# EAGLE design cytron st (EAGLE 9.3.1)
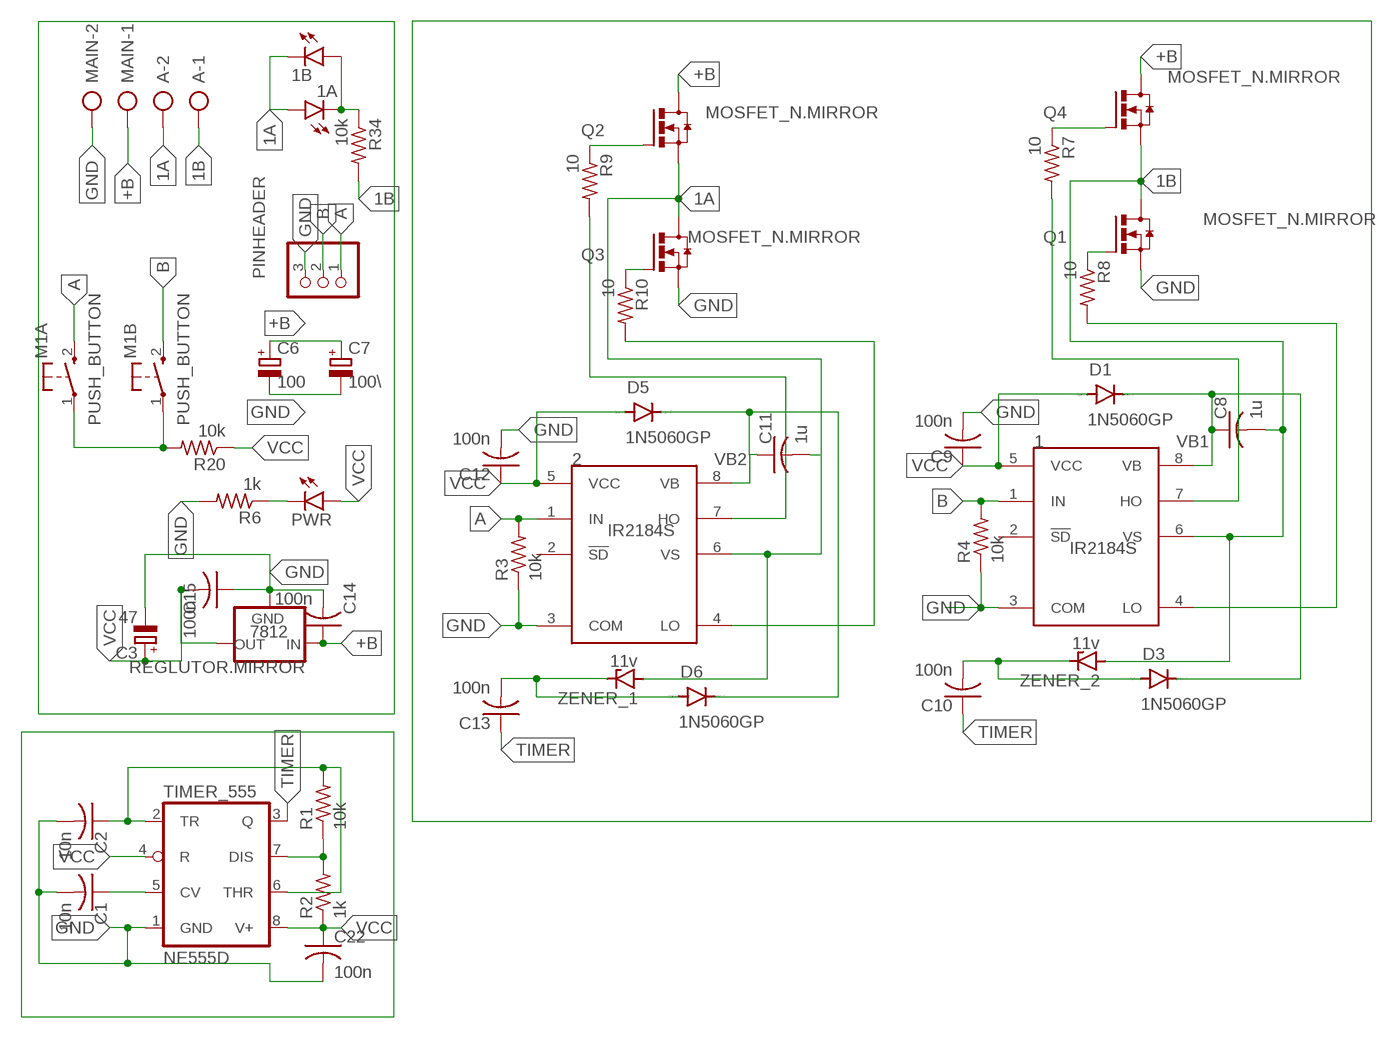
[diagram p0: schematic, sheet 1]

## Parts
1  IR2184S  [SO08]
1A  LED3MM  [LED3MM]
1B  LED3MM  [LED3MM]
2  IR2184S  [SO08]
7812  REGLUTOR.MIRROR  [78XXL.MIRROR]
A  AK300/22  [XTALRR488W60L1090T465H350B]
C1  10n  C-US025-025X050  [C025-025X050]
C2  10n  C-US025-025X050  [C025-025X050]
C3  47  CPOL-EUE5-10.5  [E5-10,5]
C6  100  CPOL-EUE5-10.5  [E5-10,5]
C7  100\  CPOL-EUE5-10.5  [E5-10,5]
C8  1u  C-US025-025X050  [C025-025X050]
C9  100n  C-US025-025X050  [C025-025X050]
C10  100n  C-US025-025X050  [C025-025X050]
C11  1u  C-US025-025X050  [C025-025X050]
C12  100n  C-US025-025X050  [C025-025X050]
C13  100n  C-US025-025X050  [C025-025X050]
C14  100n  C-US025-025X050  [C025-025X050]
C15  100n  C-US025-025X050  [C025-025X050]
C22  100n  C-US025-025X050  [C025-025X050]
D1  1N5060GP  [DO15-12]
D3  1N5060GP  [DO15-12]
D5  1N5060GP  [DO15-12]
D6  1N5060GP  [DO15-12]
M1A  PUSH_BUTTON  [B3F-10XX]
M1B  PUSH_BUTTON  [B3F-10XX]
MAIN  AK300/22  [XTALRR488W60L1090T465H350B]
PINHEADER  PINHD-1X3  [1X03]
PWR  LED5MM  [LED5MM]
Q1  MOSFET_N.MIRROR  [TO220.MIRROR]
Q2  MOSFET_N.MIRROR  [TO220.MIRROR]
Q3  MOSFET_N.MIRROR  [TO220.MIRROR]
Q4  MOSFET_N.MIRROR  [TO220.MIRROR]
R1  10k  R-US_0207/2V  [0207/2V]
R2  1k  R-US_0207/2V  [0207/2V]
R3  10k  R-US_0207/2V  [0207/2V]
R4  10k  R-US_0207/2V  [0207/2V]
R6  1k  R-US_0207/5V  [0207/5V]
R7  10  R-US_0207/5V  [0207/5V]
R8  10  R-US_0207/5V  [0207/5V]
R9  10  R-US_0207/5V  [0207/5V]
R10  10  R-US_0207/5V  [0207/5V]
R20  10k  R-US_0207/5V  [0207/5V]
R34  10k  R-US_0207/5V  [0207/5V]
TIMER_555  NE555D  [SO08]
ZENER_1  11v  BZD23  [SOD81]
ZENER_2  11v  BZD23  [SOD81]

## Nets
1A: 1A.A 1B.K(C) 2.6(VS) A.2 C11.2 Q2.S Q3.D ZENER_1.A
1B: 1.6(VS) A.1 C8.2 Q1.D Q4.S R34.2 ZENER_2.A
+B: 7812.IN C6.+ C7.+ C14.1 MAIN.1 Q2.D Q4.D
A: 2.1(IN) M1A.2(S) PINHEADER.1 R3.2
B: 1.1(IN) M1B.2(S) PINHEADER.2 R4.2
GND: 1.3(COM) 2.3(COM) 7812.GND C1.2 C2.2 C3.- C6.- C7.- C9.2 C12.2 C14.2 C15.1 C22.2 MAIN.2 PINHEADER.3 Q1.S Q3.S R3.1 R4.1 R6.2 TIMER_555.1(GND)
N$1: PWR.K(C) R6.1
N$2: C1.1 TIMER_555.5(CV)
N$3: R1.1 R2.2 TIMER_555.7(DIS)
N$4: C2.1 R1.2 TIMER_555.2(TR) TIMER_555.6(THR)
N$7: M1A.1(P) M1B.1(P) R20.2
N$9: Q4.G R7.1
N$10: Q1.G R8.1
N$12: 1.4(LO) R8.2
N$13: 1.7(HO) R7.2
N$14: C10.2 D3.A ZENER_2.C
N$15: Q3.G R10.1
N$16: Q2.G R9.1
N$17: 2.4(LO) R10.2
N$18: 2.7(HO) R9.2
N$20: C13.2 D6.A ZENER_1.C
N$45: 1A.K(C) 1B.A R34.1
TIMER: C10.1 C13.1 TIMER_555.3(Q)
VB1: 1.8(VB) C8.1 D1.C D3.C
VB2: 2.8(VB) C11.1 D5.C D6.C
VCC: 1.5(VCC) 2.5(VCC) 7812.OUT C3.+ C9.1 C12.1 C15.2 C22.1 D1.A D5.A PWR.A R2.1 R20.1 TIMER_555.4(R) TIMER_555.8(V+)
Unconnected: 1.2(!SD) 2.2(!SD)

## Library data of the parts
1 2 = irs:IR2184
1A 1B PWR = led:LED: LED OSRAM: - CHIPLED LG R971, LG N971, LY N971, LG Q971, LY Q971, LO R971, LY R971 LH N974, LH R974 LS Q976, LO Q976, LY Q976 LO Q996 - Hyper CHIPLED LW Q18S LB Q993, LB Q99A, LB R99A - SideLED LS A670, LO A670, LY A670, LG A670, LP A670 LB A673, LV A673, LT A673, LW A673 LH A674 LY A675 LS A676, LA A676, LO A676, LY A676, LW A676 LS A679, LY A679, LG A679 - Hyper Micro SIDELED® LS Y876, LA Y876, LO Y876, LY Y876 LT Y87S - SmartLED LW L88C, LW L88S LB L89C, LB L89S, LG L890 LS L89K, LO L89K, LY L89K LS L896, LA L896, LO L896, LY L896 - TOPLED LS T670, LO T670, LY T670, LG T670, LP T670 LSG T670, LSP T670, LSY T670, LOP T670, LYG T670 LG T671, LOG T671, LSG T671 LB T673, LV T673, LT T673, LW T673 LH T674 LS T676, LA T676, LO T676, LY T676, LB T676, LH T676, LSB T676, LW T676 LB T67C, LV T67C, LT T67C, LS T67K, LO T67K, LY T67K, LW E67C LS E67B, LA E67B, LO E67B, LY E67B, LB E67C, LV E67C, LT E67C LW T67C LS T679, LY T679, LG T679 LS T770, LO T770, LY T770, LG T770, LP T770 LB T773, LV T773, LT T773, LW T773 LH T774 LS E675, LA E675, LY E675, LS T675 LS T776, LA T776, LO T776, LY T776, LB T776 LHGB T686 LT T68C, LB T68C - Hyper Mini TOPLED® LB M676 - Mini TOPLED Santana® LG M470 LS M47K, LO M47K, LY M47K Source: http://www.osram.convergy.de LUXEON: - LUMILED® LXK2-PW12-R00, LXK2-PW12-S00, LXK2-PW14-U00, LXK2-PW14-V00 LXK2-PM12-R00, LXK2-PM12-S00, LXK2-PM14-U00 LXK2-PE12-Q00, LXK2-PE12-R00, LXK2-PE12-S00, LXK2-PE14-T00, LXK2-PE14-U00 LXK2-PB12-K00, LXK2-PB12-L00, LXK2-PB12-M00, LXK2-PB14-N00, LXK2-PB14-P00, LXK2-PB14-Q00 LXK2-PR12-L00, LXK2-PR12-M00, LXK2-PR14-Q00, LXK2-PR14-R00 LXK2-PD12-Q00, LXK2-PD12-R00, LXK2-PD12-S00 LXK2-PH12-R00, LXK2-PH12-S00 LXK2-PL12-P00, LXK2-PL12-Q00, LXK2-PL12-R00 Source: www.luxeon.com KINGBRIGHT: KA-3528ASYC Source: www.kingbright.com
7812 = MOSFET MIRROR:REGLUTOR.MIRROR
A MAIN = con-ptr50056:AK300/2: CONNECTOR
C1 C2 C9 C10 C12-C15 C22 = rcl8:C-US: CAPACITOR, American symbol; SPICEPREFIX: C
C3 C6 C7 = rcl8:CPOL-EU: POLARIZED CAPACITOR, European symbol; SPICEPREFIX: C
C8 C11 = rcl:C-US: CAPACITOR, American symbol; SPICEPREFIX: C
D1 D3 D5 D6 = diode:1N5060GP: DIODE controlled avalanche rectifier
M1A M1B = MIA_LIBRARY (1):PUSH_BUTTON: OMRON SWITCH
PINHEADER = pinhead:PINHD-1X3: PIN HEADER
Q1-Q4 = MIA_LIBRARY (1):MOSFET_N.MIRROR
R1-R4 R6-R10 R20 R34 = rcl:R-US_: RESISTOR, American symbol; SPICEPREFIX: R
TIMER_555 = linear:*555: TIMER
ZENER_1 ZENER_2 = diode:BZD23: Z DIODE

## Board
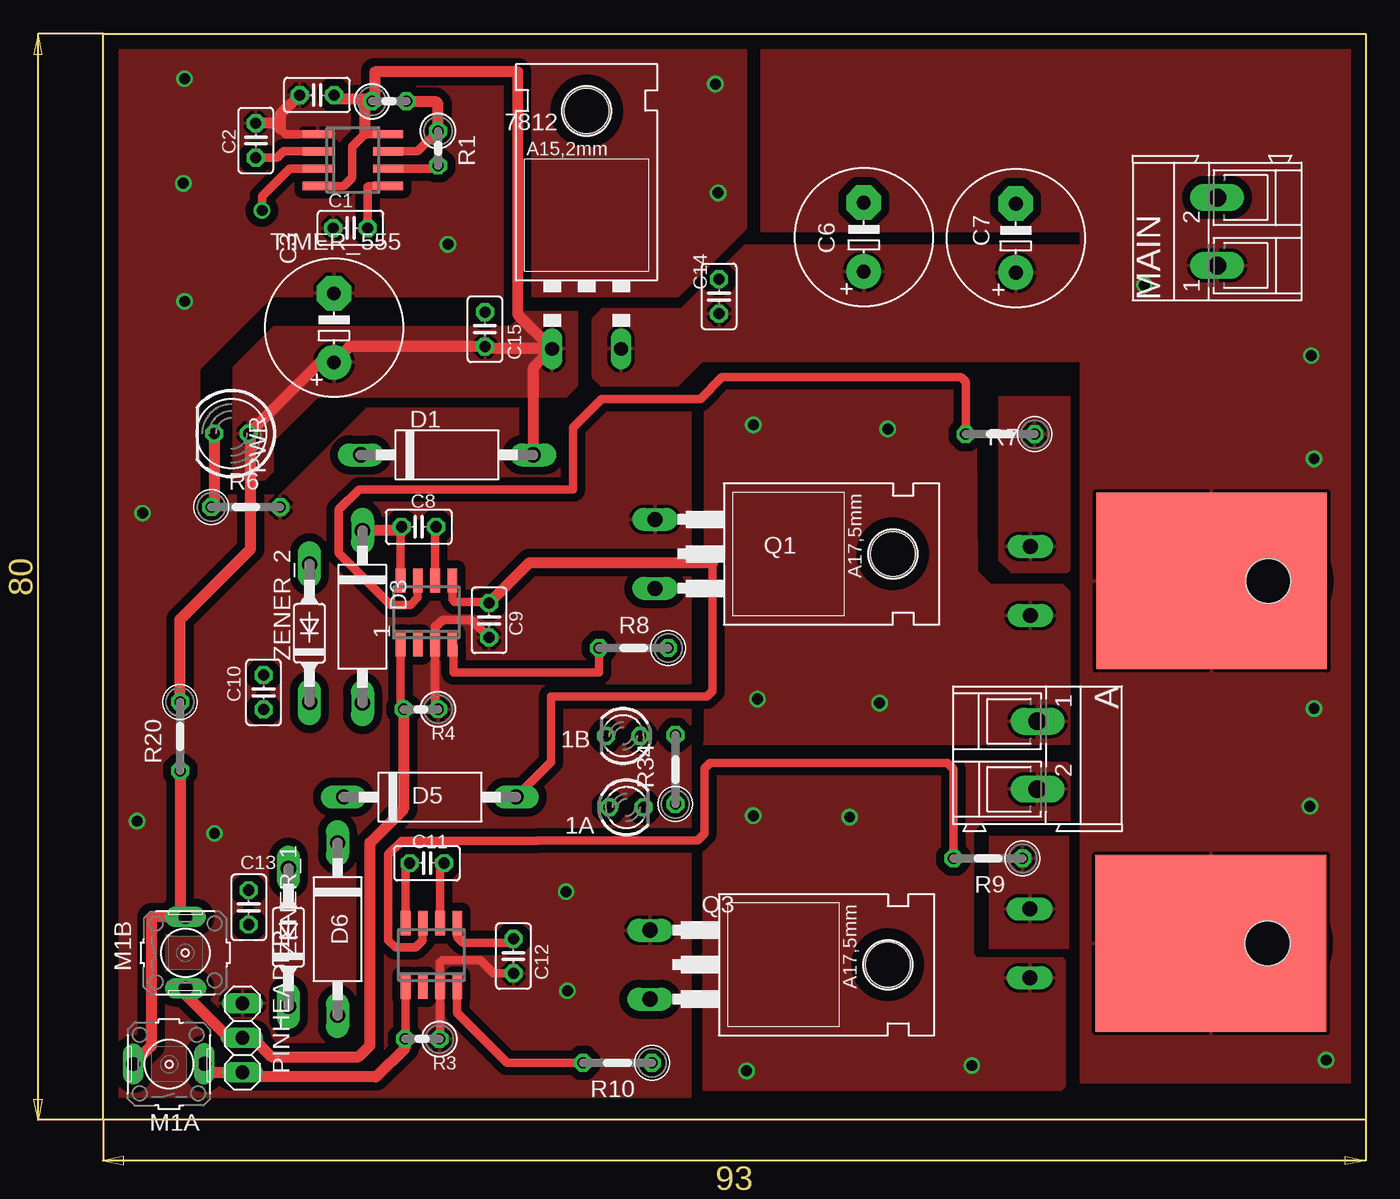
[diagram p1: board, top side]
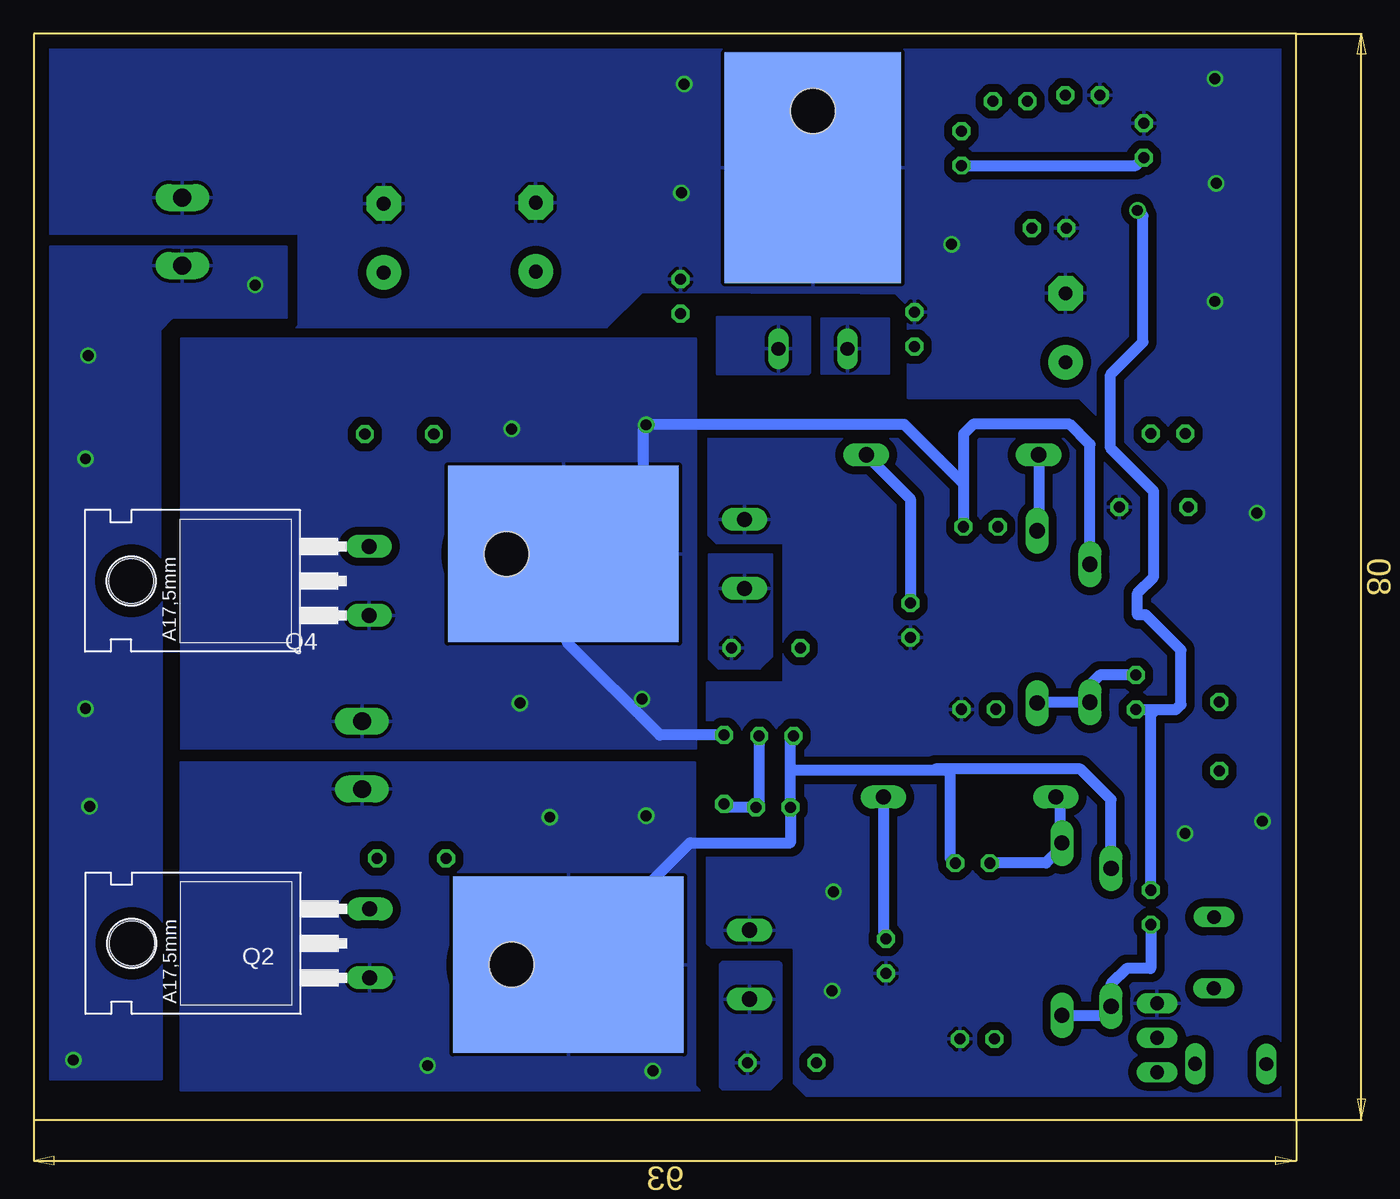
[diagram p2: board, bottom side, seen from below]

Size 93 x 80 mm. Coordinates in mm from the lower left corner, seen from the top.
Outline: 0,0 0,80 93,80 93,0 0,0
Copper layers (1*16): Top 0.035mm / dielectric 1.5mm / Bottom 0.035mm
Design rules "default *": minimum track width 0.015240625mm, minimum drill 0.8mm, track to track 0.6mm, track to pad 0.6mm, pad to pad 0.4mm, via to via 6mil, smd to smd 6mil, copper to edge 40mil, drill to drill 6mil, minimum pad ring 10mil, minimum via ring 8mil, stop-mask expansion 4mil, vias tented up to drill 0mil, thermal gap 10mil

### Footprints (pad centres in the part's own frame; a part is rotated, then mirrored left to right if it is on the bottom)
SO08 = smd 0.72 x 1.78: 1 -1.905,-2.35; 2 -0.635,-2.35; 3 0.635,-2.35; 4 1.905,-2.35; 5 1.905,2.35; 6 0.635,2.35; 7 -0.635,2.35; 8 -1.905,2.35
LED3MM = drill 0.813 octagon: A -1.27,0; K 1.27,0
78XXL.MIRROR = smd 13 x 17 bottom: GND 0,7 | drill 1.016 long: IN 2.54,-6.35; OUT -2.54,-6.35 | hole 3.302: 0,11.176
XTALRR488W60L1090T465H350B = drill 1.321 long: 1 -2.515,-1.27; 2 2.489,-1.27
C025-025X050 = drill 0.813 octagon: 1 -1.27,0; 2 1.27,0
E5-10,5 = drill 1.016 pad 2.54: + -2.54,0 | drill 1.016 pad 2.54 octagon: - 2.54,0
DO15-12 = drill 1.118 long: A 6.35,0; C -6.35,0
B3F-10XX = drill 1.016 long: 1 0.013,2.636; 2 0.029,-2.605
1X03 = drill 1.016 long: 1 -2.54,0; 2 0,0; 3 2.54,0
LED5MM = drill 0.813 octagon: A -1.27,0; K 1.27,0
TO220.MIRROR = smd 13 x 17 bottom: D 0,7 | drill 1.118 long: G 2.54,-6.35; S -2.54,-6.35 | hole 3.302: 0,11.176
0207/2V = drill 0.813 octagon: 1 -1.27,0; 2 1.27,0
0207/5V = drill 0.813 octagon: 1 -2.54,0; 2 2.54,0
SO08' = smd 0.6 x 2.2: 1 -1.905,-2.6; 2 -0.635,-2.6; 3 0.635,-2.6; 4 1.905,-2.6; 5 1.905,2.6; 6 0.635,2.6; 7 -0.635,2.6; 8 -1.905,2.6
SOD81 = drill 1.118 long: A 5.08,0; C -5.08,0

### Placement (x,y rotation side)
1  23.82,37.38 0 top
1A  38.55,23.02 0 top
1B  38.3,28.28 180 top
2  24.18,12.14 0 top
7812  35.62,63.15 0 top
A  70.1,26.85 270 top
C1  18.22,65.7 180 top
C2  11.25,72.15 90 top
C3  17,58.35 90 top
C6  56.03,65.03 90 top
C7  67.23,64.96 90 top
C8  23.25,43.69 0 top
C9  28.43,36.8 270 top
C10  11.82,31.49 90 top
C11  23.85,18.91 0 top
C12  30.22,12.06 270 top
C13  10.72,15.65 270 top
C14  45.37,60.66 90 top
C15  28.12,58.24 270 top
C22  15.75,75.5 180 top
D1  25.33,48.99 0 top
D3  19.1,37.05 270 top
D5  24.07,23.78 0 top
D6  17.27,14.04 270 top
M1A  4.85,4.1 90 top
M1B  6.05,12.3 0 top
MAIN  80.8,65.45 90 top
PINHEADER  10.26,6.04 90 top
PWR  9.45,50.56 180 top
Q1  47,41.69 270 top
Q2  74.61,13 90 bottom
Q3  46.63,11.43 270 top
Q4  74.65,39.7 90 bottom
R1  24.67,71.58 270 top
R2  21.07,75.04 0 top
R3  23.5,5.95 180 top
R4  23.4,30.25 180 top
R6  10.51,45.14 0 top
R7  66.08,50.51 180 top
R8  39.08,34.76 180 top
R9  65.19,19.26 180.1 top
R10  37.89,4.2 180 top
R20  5.66,28.25 270 top
R34  42.15,25.8 90 top
TIMER_555  NE555D  [SO08']  18.4,70.71 270 top
ZENER_1  13.65,13.45 90 top
ZENER_2  15.2,35.85 90 top

### Tracks (layer width: path | path; a pad name or v marks a point on that pad's centre or on a via)
1A  (via drill 0.8)
  Top 0.61: 2.6 24.82,18.61 C11.2
  Bottom 0.813: Q3.D 44.65,20.41 37.28,20.41 1A.A 37.28,25.75 | 37.28,25.75 37.28,28.03 1B.K | C11.2 25.5,19.29 25.5,25.75 26.5,25.75 | 26.5,25.75 26.6,25.85 15.9,25.85 13.65,23.6 ZENER_1.A | 26.5,25.75 37.28,25.75
  other vias: 64,4 47.4,3.6 47.9,22.4 55,22.3
  pour Bottom (isolate 0.6): 44.3,26.35 44.3,2.55 43.9,2.15 82.2,2.15 82.2,26.35
  pour Top: 71,26.3 44.8,26.3 44.2,25.7 44.2,2.2 70.6,2.2 70.9,2.5 70.9,11.7 70.7,11.9 64.4,11.9 64.1,12.2 64.1,21.3 64.9,22.1 71.1,22.1 71.2,22 71.2,26.1
1B  (via drill 0.8)
  Top 0.61: 1.6 24.45,43.62 C8.2
  Bottom 0.813: Q1.D 60.06,41.69 | Q1.D 48.1,47.59 48.1,51.25 28.9,51.25 24.52,46.87 | 24.52,46.87 C8.2 | ZENER_2.A 15.2,49.75 16.7,51.25 23.8,51.25 24.52,50.53 24.52,46.87 | R34.2 46.89,28.34 53.72,35.17 53.72,38.95 | 53.72,38.95 53.72,39.64 53.58,39.79 53.58,41.97 | Q1.D 54,39.23 53.72,38.95
  other vias: 48.2,31 57.2,30.7 57.8,50.9 47.9,51.2
  pour Bottom (isolate 0.6): 82.2,27.35 44.2,27.35 44.2,57.55 82.2,57.55
  pour Top: 64.31,54.8 44.4,54.8 44.3,54.9 44.3,27.8 44.2,27.7 71.2,27.7 71.2,38.9 70.7,39.4 65.4,39.4 64.41,40.39
+B  (via drill 0.8)
  other vias: 88.9,23.1 90.1,4.4 89.2,30.3 89,56.3 89.2,48.7 76.7,61.5
  pour Top (isolate 0.6): 72,79.35 72,2.75 92.15,2.75 92.15,79.35
  pour Top (isolate 0.6): 73.3,55.85 44.1,55.85 42.3,54.05 36.7,54.05 36.1,54.65 36.1,59.05 36.8,59.75 42.6,59.75 47.3,64.45 73.1,64.45 74,63.55 74,56.55
  pour Bottom (isolate 0.6): 42.7,54.95 35.9,54.95 35.8,55.05 35.8,59.15 42.7,59.15
  pour Bottom (isolate 0.6): 74.4,64.35 74.4,59.05 82.8,59.05 83.7,58.15 83.7,41.15 83.6,41.05 83.6,2.95 91.8,2.95 91.8,64.35
  pour Top (isolate 0.6): 73.2,65.45 48.5,65.45 48.5,78.85 75.9,78.85 75.9,67.05 77.7,65.25 87.6,65.25 87.6,60.25 87.3,59.95 73.5,59.95 73.2,60.25
A
  Top 0.61: R3.2 22.27,6 2.1
  Top 0.813: R3.2 22.23,5.28 20.1,3.15 10.3,3.15 10.26,3.19 PINHEADER.1 8.08,3.5 M1A.2
B
  Top 0.61: 1.1 21.91,30.46 R4.2
  Top 0.813: R4.2 22.13,22.88 19.66,20.41 19.66,5.49 18.83,4.66 12.39,4.66 11.01,6.04 PINHEADER.2 9.06,6.04 9.06,6.24 6.08,9.22 M1B.2
GND  (via drill 0.8)
  Top 0.61: TIMER_555.1 13.44,72.61 13.05,73 12.63,73.42 | C9.2 27.14,36.83 24.99,36.83 24.56,36.4 24.45,36.4 1.3 24.45,30.46 R4.1 | C12.2 28.76,10.79 27.8,11.74 25,11.74 24.8,11.55 24.8,11.06 24.81,11.05 2.3 24.82,6 R3.1
  Top 0.813: 12.63,73.42 C2.2 | C22.2 13.05,74.07 13.05,73
  other vias: 6,76.7 5.9,69 6,60.3 2.9,44.7 2.5,22 8.2,21.1 34.2,9.5 34.1,16.8 25.4,64.5 45.1,76.3 45.3,68.3
  pour Bottom (isolate 0.6): 73.5,58.55 73.5,65.25 92.4,65.25 92.4,79.55 8,79.55 8,60.74 48.21,60.94 50.8,58.35 73.7,58.35
  pour Bottom (isolate 0.6): 37,2.65 37,12.55 37.1,12.65 43.1,12.65 43.4,12.95 43.4,32.25 37.8,32.25 37.8,42.45 42.7,42.45 43.3,43.05 43.3,53.05 42.2,54.15 1,54.15 1,1.75 36.1,1.75
  pour Bottom (isolate 0.6): 43.4,61.45 43.4,79.85 0.9,79.85 0.9,47.95 12.4,47.95 13.9,49.45 13.9,51.05 16,53.15 28.6,53.15 28.6,59.95 30,61.35 43.3,61.35
  pour Top: 47.4,78.9 1.1,78.9 1.1,1.7 43.3,1.7 43.3,52.4 19.4,52.4 13,46 8.8,46 7.1,47.7 7.1,55.3 12.5,60.7 42.4,60.7 47.4,65.7
N$1
  Top 0.813: PWR.K 8.18,45.35 R6.1
N$2
  Top 0.61: TIMER_555.5 19.55,68.8 19.49,68.74 C1.1
N$3
  Top 0.61: TIMER_555.7 23.16,71.34 R1.1
  Top 0.813: R1.1 24.67,74.85 24.48,75.04 R2.2
N$4
  Top 0.61: TIMER_555.2 13.29,71.34 12.83,70.88 C2.1 | TIMER_555.6 24.43,70.08 R1.2
  Bottom 0.813: R1.2 11.82,70.31 C2.1
N$7
  Top 0.813: R20.2 5.66,15.34 M1B.1 3.55,14.94 3.55,5.45 M1A.1
N$9
  Top 0.813: Q4.G 67.96,42.24
  pour Top (isolate 0.6): 71.2,40.55 71.2,53.25 66,53.25 66,41.25 66.9,40.35 71,40.35
N$10
  pour Bottom (isolate 0.6): 43.3,41.65 43.3,33.95 42.6,33.25 39.5,33.25 38.6,34.15 38.6,41.65
N$12
  Top 0.61: 1.4 25.8,34.95 25.8,32.95 36.54,32.95 R8.2
N$13
  Top 0.61: 1.7 23.18,38.47 22.65,37.94 21.18,37.94 17.36,41.76 17.36,44.96 18.85,46.45 34.6,46.45 34.6,51 36.7,53.1 44,53.1 45.6,54.7 63.2,54.7 63.54,54.36 R7.2
N$14
  Bottom 0.813: D3.A 19.03,30.77 ZENER_2.C | ZENER_2.C 14.89,31.07 | C10.2 14.49,32.76 15.4,31.85 15.2,31.65 ZENER_2.C
N$15
  pour Bottom (isolate 0.6): 42.5,11.45 42.5,2.45 42.3,2.25 38.7,2.25 37.9,3.05 37.9,11.45 38.1,11.65 42.3,11.65
N$16
  pour Top (isolate 0.6): 71.1,12.65 71.1,20.85 65.3,20.85 65.3,12.65
N$17
  Top 0.61: 2.4 26.09,7.87 29.75,4.2 R10.2
N$18
  Top 0.61: 2.7 23.54,13.22 23.01,12.7 21.54,12.7 21.01,13.22 21.01,19.55 22.01,20.55 32,20.55 32.05,20.6 43.8,20.6 44.3,21.1 44.3,25.9 44.7,26.3 62.2,26.3 62.65,25.85 R9.2
N$20
  Bottom 0.813: D6.A 14.33,7.69 ZENER_1.C 13.65,10 12.5,11.15 10.72,11.15 C13.2
N$45
  Bottom 0.813: 1B.A 39.57,23.27 1A.K 41.91,23.02 R34.1
TIMER  (via drill 0.8)
  Top 0.61: TIMER_555.3 13.74,70.08 11.7,68.04 v11.7,67
  Bottom 0.813: C10.1 10.35,30.22 | 10.35,30.22 8.88,30.22 8.5,30.6 8.5,34.6 11.1,37.2 11.7,37.2 11.7,38.8 10.5,40 10.5,46.3 13.7,49.5 13.7,54.9 11.3,57.3 11.3,66.6 v11.7,67 | C13.1 10.72,29.85 10.35,30.22
VB1
  Top 0.61: 1.8 21.91,43.62 C8.1
  Top 0.813: C8.1 21.69,43.4 D3.C
  Bottom 0.813: D1.C 18.98,43.52 D3.C
VB2
  Top 0.61: 2.8 22.27,18.61 C11.1
  Bottom 0.813: D5.C 17.42,23.48 17.42,20.54 D6.C 17.27,20.09 18.45,18.91 C11.1
VCC
  Top 0.61: 16.75,68.77 17.72,68.77 18.35,69.4 18.35,71.7 19.27,72.61 TIMER_555.8 | 16.75,68.77 15.15,68.77 | TIMER_555.4 16.71,68.81 16.75,68.77 | R2.1 19.39,75.04 | 19.59,75.24 19.39,75.04 | 19.39,75.04 19.25,74.9 19.27,74.89 | C22.1 17.28,75.24 | 1.5 25.73,38.33 25.9,38.15 28.35,38.15 C9.1 | 2.5 26.09,13.46 26.52,13.03 29.92,13.03 C12.1 | 44.9,41.05 44.9,31.6 44.5,31.2 33,31.2 33,26.36 D5.A
  Top 0.813: 19.27,74.89 19.27,72.61 | 17.28,75.24 19.59,75.24 | 7812.OUT 31.68,55.4 D1.A | C9.1 31.41,41.05 44.9,41.05 | 7812.OUT 28.29,56.8 C15.2 18.16,56.97 C3.+ 15.97,55.81 PWR.A | 10.6,50.44 PWR.A | 7812.OUT 30.55,59.33 30.55,77.2 20,77.2 20,75.24 R2.1 | R20.1 5.66,36.86 10.85,42.05 10.85,50.43 PWR.A
  Bottom 0.813: D1.A 28.43,45.74 C9.1 | D5.A 30.42,13.53 C12.1
  pour Top (isolate 0.6): 34.9,59.55 34.9,54.05 34.1,53.25 15.8,53.25 12.5,49.95 12.5,47.75 11.9,47.15 9.6,47.15 9.6,55.45 12.6,58.45 30,58.45 31.1,59.55
  pour Bottom (isolate 0.6): 35,59.05 30,59.05 30,54.95 35,54.95